# Altium schematic sheet SML-230109PCB1__PWR.SchDoc
size A4; DocumentNumber: 2; SheetNumber: 2; SheetTotal: 6
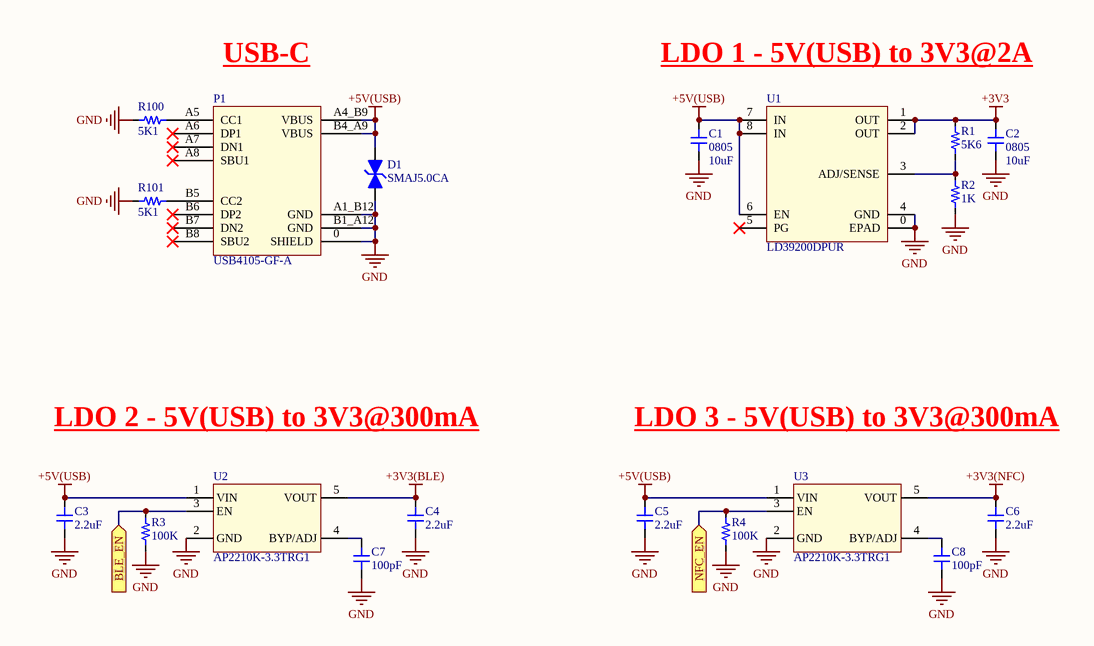
[diagram p0: SML-230109PCB1__PWR.SchDoc]

## Parts
C1  value 10uF  [06] - Package: 0805  [[G] CAP-MLCC__0805]  (hidden comment: .)
C2  value 10uF  [06] - Package: 0805  [[G] CAP-MLCC__0805]  (hidden comment: .)
C3  value 2.2uF  [[G] CAP-MLCC__0603]  (hidden comment: .)
C4  value 2.2uF  [[G] CAP-MLCC__0603]  (hidden comment: .)
C5  value 2.2uF  [[G] CAP-MLCC__0603]  (hidden comment: .)
C6  value 2.2uF  [[G] CAP-MLCC__0603]  (hidden comment: .)
C7  value 100pF  [[G] CAP-MLCC__0603]  (hidden comment: .)
C8  value 100pF  [[G] CAP-MLCC__0603]  (hidden comment: .)
D1  .  [[G] SMA(DO-214AC)__W/O]  (value not drawn)
P1  .  [CONN-USB-C__USB4105-GF-A]  (value not drawn)
R1  value 5K6  [[G] RES-CHIP__0603]  (hidden comment: .)
R2  value 1K  [[G] RES-CHIP__0603]  (hidden comment: .)
R3  value 100K  [[G] RES-CHIP__0603]  (hidden comment: .)
R4  value 100K  [[G] RES-CHIP__0603]  (hidden comment: .)
R100  value 5K1  [[G] RES-CHIP__0402]  (hidden comment: .)
R101  value 5K1  [[G] RES-CHIP__0402]  (hidden comment: .)
U1  .  [PMIC-LDO__LD39200DPUR__DFN-8(4X4)]  (value not drawn)
U2  .  [[G] SOT23-5]  (value not drawn)
U3  .  [[G] SOT23-5]  (value not drawn)

## Ports
BLE_EN (in, see 3[1A]), NFC_EN (in, see 3[1A])

## Nets
+3V3: C2.2 R1.2 U1.1(OUT) U1.2(OUT)
+3V3(BLE): C4.2 U2.5(VOUT)
+3V3(NFC): C6.2 U3.5(VOUT)
+5V(USB): C1.2 C3.2 C5.2 D1.K P1.A4_B9(VBUS) P1.B4_A9(VBUS) U1.6(EN) U1.7(IN) U1.8(IN) U2.1(VIN) U3.1(VIN)
GND: C1.1 C2.1 C3.1 C4.1 C5.1 C6.1 C7.1 C8.1 D1.A P1.0(SHIELD) P1.A1_B12(GND) P1.B1_A12(GND) R2.1 R3.1 R4.1 R100.1 R101.1 U1.0(EPAD) U1.4(GND) U2.2(GND) U3.2(GND)
BLE_EN: R3.2 U2.3(EN) ; port BLE_EN
NFC_EN: R4.2 U3.3(EN) ; port NFC_EN
NetC7_2: C7.2 U2.4(BYP/ADJ)
NetC8_2: C8.2 U3.4(BYP/ADJ)
NetP1_A5: P1.A5(CC1) R100.2
NetP1_B5: P1.B5(CC2) R101.2
NetR1_1: R1.1 R2.2 U1.3(ADJ/SENSE)

Not connected (* = marked no-connect by the designer): P1 A6(DP1)* A7(DN1)* A8(SBU1)* B6(DP2)* B7(DN2)* B8(SBU2)*; U1 5(PG)*

## Notes on the sheet
- (near P1) USB-C
- LDO 1 - 5V(USB) to 3V3@2A
- LDO 2 - 5V(USB) to 3V3@300mA
- LDO 3 - 5V(USB) to 3V3@300mA
- Title
- Size:
- Date:
- A4
- Number:
- Revision:
- Sheet
- of
- SEMILLA3 OÜ
- Seebi tn 1-1501, Tallinn 11316. Estonia.
- Registry No.: 16636757
- VAT No. EE102568505
- File:

## Library data of the parts
C1 C2 = CAP_MLCC_0805: CAP MLCC 0805; [00] - Description (BOM): CAP MLCC 10uF 0805 010; [04] - Power features: 010; STAR Code: C10uF0805010; [01] - MPN Code: *; [02] - Manufacturer: *; [03] - Datasheet: *; [05] - Temperature range: *; [07] - PVP Dealer name: *; [08] - PVP 1K: *; Voltage: 010
C3-C6 = CAP_MLCC_0603: CAP MLCC 0603; [00] - Description (BOM): CAP MLCC 2.2uF 0603 010; [04] - Power features: 010; STAR Code: C2.2uF0603010; [06] - Package: 0603; [01] - MPN Code: *; [02] - Manufacturer: *; [03] - Datasheet: *; [05] - Temperature range: *; [07] - PVP Dealer name: *; [08] - PVP 1K: *; Voltage: 010
C7 C8 = CAP_MLCC_0603: CAP MLCC 0603; [00] - Description (BOM): CAP MLCC 100pF 0603 010; [04] - Power features: 010; STAR Code: C100pF0603010; [06] - Package: 0603; [01] - MPN Code: *; [02] - Manufacturer: *; [03] - Datasheet: *; [05] - Temperature range: *; [07] - PVP Dealer name: *; [08] - PVP 1K: *; Voltage: 010
D1 = SMAJ5.0CA: DIODE TVS, SMA (DO-214AC), Vr=5V, Vbr=6'4V, Vc=9'2V, Ipp=43'5A, Pppm=400W; [02] - Manufacturer: Littelfuse; [05] - Temperature range: -65 to +150 ºC; [00] - Description (BOM): DIODE TVS, SMA (DO-214AC), Vr=5V, Vbr=6'4V, Vc=9'2V, Ipp=43'5A, Pppm=400W; [03] - Datasheet: https://www.littelfuse.com/media?resourcetype=datasheets&itemid=75e32973-b177-4ee3-a0ff-cedaf1abdb93&filename=smaj-datasheet; [04] - Power features: Vr=5V, Vbr=6'4V, Vc=9'2V, Ipp=43'5A; [06] - Package: SMA (DO-214AC); [07] - PVP Dealer name: *; [08] - PVP 1K: *; STAR Code: *; [01] - MPN Code: SMAJ5.0CA
P1 = USB4105-GF-A: CONN USB TYPE C, smd/th, right angle; [02] - Manufacturer: GCT; [04] - Power features: 20VDC, 5A (VBUS); [05] - Temperature range: -40 to +85 ºC; [00] - Description (BOM): CONN USB TYPE C, smd/th, right angle; [03] - Datasheet: https://www.mouser.es/datasheet/2/837/USB4105-2888174.pdf; [06] - Package: *; [07] - PVP Dealer name: *; [08] - PVP 1K: *; STAR Code: *; [01] - MPN Code: USB4105-GF-A
R1 = RES_SMD_0603: RES SMD 0603 [G]; [00] - Description (BOM): RES 5K6 OHM 0603 1% 1/10W; [04] - Power features: 100mW; STAR Code: 5K606031%; Tolerance: 1%; [06] - Package: 0603; [01] - MPN Code: *; [02] - Manufacturer: *; [03] - Datasheet: *; [05] - Temperature range: *; [07] - PVP Dealer name: *; [08] - PVP 1K: *
R2 = RES_SMD_0603: RES SMD 0603 [G]; [00] - Description (BOM): RES 1K OHM 0603 1% 1/10W; [04] - Power features: 100mW; STAR Code: 1K06031%; Tolerance: 1%; [06] - Package: 0603; [01] - MPN Code: *; [02] - Manufacturer: *; [03] - Datasheet: *; [05] - Temperature range: *; [07] - PVP Dealer name: *; [08] - PVP 1K: *
R3 R4 = RES_SMD_0603: RES SMD 0603 [G]; [00] - Description (BOM): RES 100K OHM 0603 1% 1/10W; [04] - Power features: 100mW; STAR Code: 100K06031%; Tolerance: 1%; [06] - Package: 0603; [01] - MPN Code: *; [02] - Manufacturer: *; [03] - Datasheet: *; [05] - Temperature range: *; [07] - PVP Dealer name: *; [08] - PVP 1K: *
R100 R101 = RES_SMD_0402: RES SMD 0402 [G]; [00] - Description (BOM): RES 5K1 OHM 0402 1% 1/16W; [04] - Power features: 62.5mW; STAR Code: 5K104021%; Tolerance: 1%; [06] - Package: 0402; [01] - MPN Code: *; [02] - Manufacturer: *; [03] - Datasheet: *; [05] - Temperature range: *; [07] - PVP Dealer name: *; [08] - PVP 1K: *
U1 = LD39200DPUR: PMIC LDO, DFN-8, Vout=ADJ, Iout=2000A, Vin=1'25-6'0V, Vdrop-max=130mV, Iq-max=1mA; [02] - Manufacturer: ST Microelectronics; [05] - Temperature range: -40 to +125 ºC; [06] - Package: DFN-8 (4x4mm); [00] - Description (BOM): PMIC LDO, DFN-8, Vout=ADJ, Iout=2000A, Vin=1'25-6'0V, Vdrop-max=130mV, Iq-max=1mA; [03] - Datasheet: https://www.mouser.es/datasheet/2/389/dm00102135-1798033.pdf; [04] - Power features: Vout=ADJ, Iout=2000A, Vin=1'25-6'0V, Vdrop-max=130mV, Iq-max=1mA; [07] - PVP Dealer name: *; [08] - PVP 1K: *; STAR Code: *; [01] - MPN Code: LD39200DPUR
U2 U3 = AP2210K-3.3TRG1: PMIC LDO, SOT23-5, Vout=3'3V, Iout=300mA, Vin=2'5-13'2V, Vdrop-max=250mV, Iq-max=4mA; [02] - Manufacturer: Diodes Incorporated; [05] - Temperature range: -40 to +125 ºC; [00] - Description (BOM): PMIC LDO, SOT23-5, Vout=3'3V, Iout=300mA, Vin=2'5-13'2V, Vdrop-max=250mV, Iq-max=4mA; [03] - Datasheet: https://www.diodes.com/assets/Datasheets/AP2210.pdf; [04] - Power features: Vout=3'3V, Iout=300mA, Vin=2'5-13'2V, Vdrop-max=250mV, Iq-max=4mA; [06] - Package: SOT23-5; [07] - PVP Dealer name: *; [08] - PVP 1K: *; STAR Code: *; [01] - MPN Code: AP2210K-3.3TRG1